# EAGLE design C64 ROM Selector (EAGLE 9.6.1)
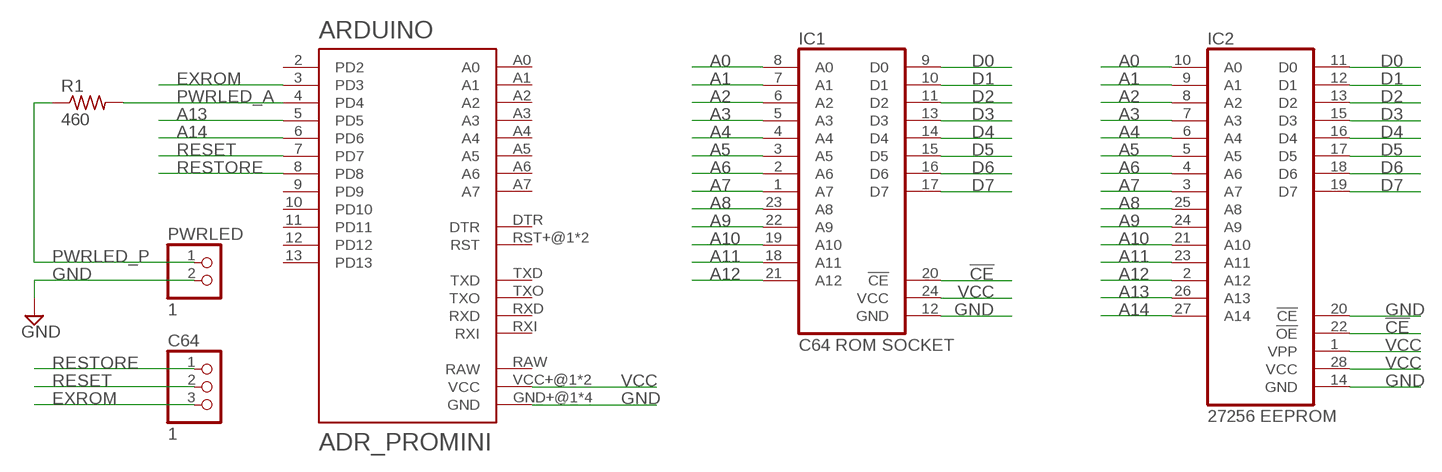
[diagram p0: schematic, sheet 1]

## Parts
ARDUINO  ADR_PROMINI  [ARDUINO_PRO_MINI]
C64  1  PINHD-1X3  [1X03]
IC1  C64 ROM SOCKET  2364  [DIL24]
IC2  27256 EEPROM  27256  [DIL28]
PWRLED  1  PINHD-1X2  [1X02]
R1  460  R-US_0204/7  [0204/7]

## Nets
!CE: IC1.20(!CE) IC2.22(!OE)
A0: IC1.8(A0) IC2.10(A0)
A1: IC1.7(A1) IC2.9(A1)
A2: IC1.6(A2) IC2.8(A2)
A3: IC1.5(A3) IC2.7(A3)
A4: IC1.4(A4) IC2.6(A4)
A5: IC1.3(A5) IC2.5(A5)
A6: IC1.2(A6) IC2.4(A6)
A7: IC1.1(A7) IC2.3(A7)
A8: IC1.23(A8) IC2.25(A8)
A9: IC1.22(A9) IC2.24(A9)
A10: IC1.19(A10) IC2.21(A10)
A11: IC1.18(A11) IC2.23(A11)
A12: IC1.21(A12) IC2.2(A12)
A13: ARDUINO.5(PD5) IC2.26(A13)
A14: ARDUINO.6(PD6) IC2.27(A14)
D0: IC1.9(D0) IC2.11(D0)
D1: IC1.10(D1) IC2.12(D1)
D2: IC1.11(D2) IC2.13(D2)
D3: IC1.13(D3) IC2.15(D3)
D4: IC1.14(D4) IC2.16(D4)
D5: IC1.15(D5) IC2.17(D5)
D6: IC1.16(D6) IC2.18(D6)
D7: IC1.17(D7) IC2.19(D7)
EXROM: ARDUINO.3(PD3) C64.3
GND: ARDUINO.GND+@1(GND) ARDUINO.GND+@2(GND) ARDUINO.GND+@3(GND) ARDUINO.GND+@4(GND) IC1.12(GND) IC2.14(GND) IC2.20(!CE) PWRLED.2
PWRLED_A: ARDUINO.4(PD4) R1.2
PWRLED_P: PWRLED.1 R1.1
RESET: ARDUINO.7(PD7) C64.2
RESTORE: ARDUINO.8(PD8) C64.1
VCC: ARDUINO.VCC+@1(VCC) ARDUINO.VCC+@2(VCC) IC1.24(VCC) IC2.1(VPP) IC2.28(VCC)
Unconnected: ARDUINO.2(PD2) ARDUINO.9(PD9) ARDUINO.10(PD10) ARDUINO.11(PD11) ARDUINO.12(PD12) ARDUINO.13(PD13) ARDUINO.A0 ARDUINO.A1 ARDUINO.A2 ARDUINO.A3 ARDUINO.A4 ARDUINO.A5 ARDUINO.A6 ARDUINO.A7 ARDUINO.DTR ARDUINO.RST+@1(RST) ARDUINO.RST+@2(RST) ARDUINO.RXD ARDUINO.RXI ARDUINO.TXD ARDUINO.TXO

## Power pins joined to a net without a drawn wire
RAW: ARDUINO.RAW

## Library data of the parts
ARDUINO = myparts:ADR_PROMINI
C64 = pinhead:PINHD-1X3: PIN HEADER
IC1 = myparts:2364: MEMORY
IC2 = myparts:27256: MEMORY
PWRLED = pinhead:PINHD-1X2: PIN HEADER
R1 = rcl:R-US_: RESISTOR, American symbol; SPICEPREFIX: R

## Board
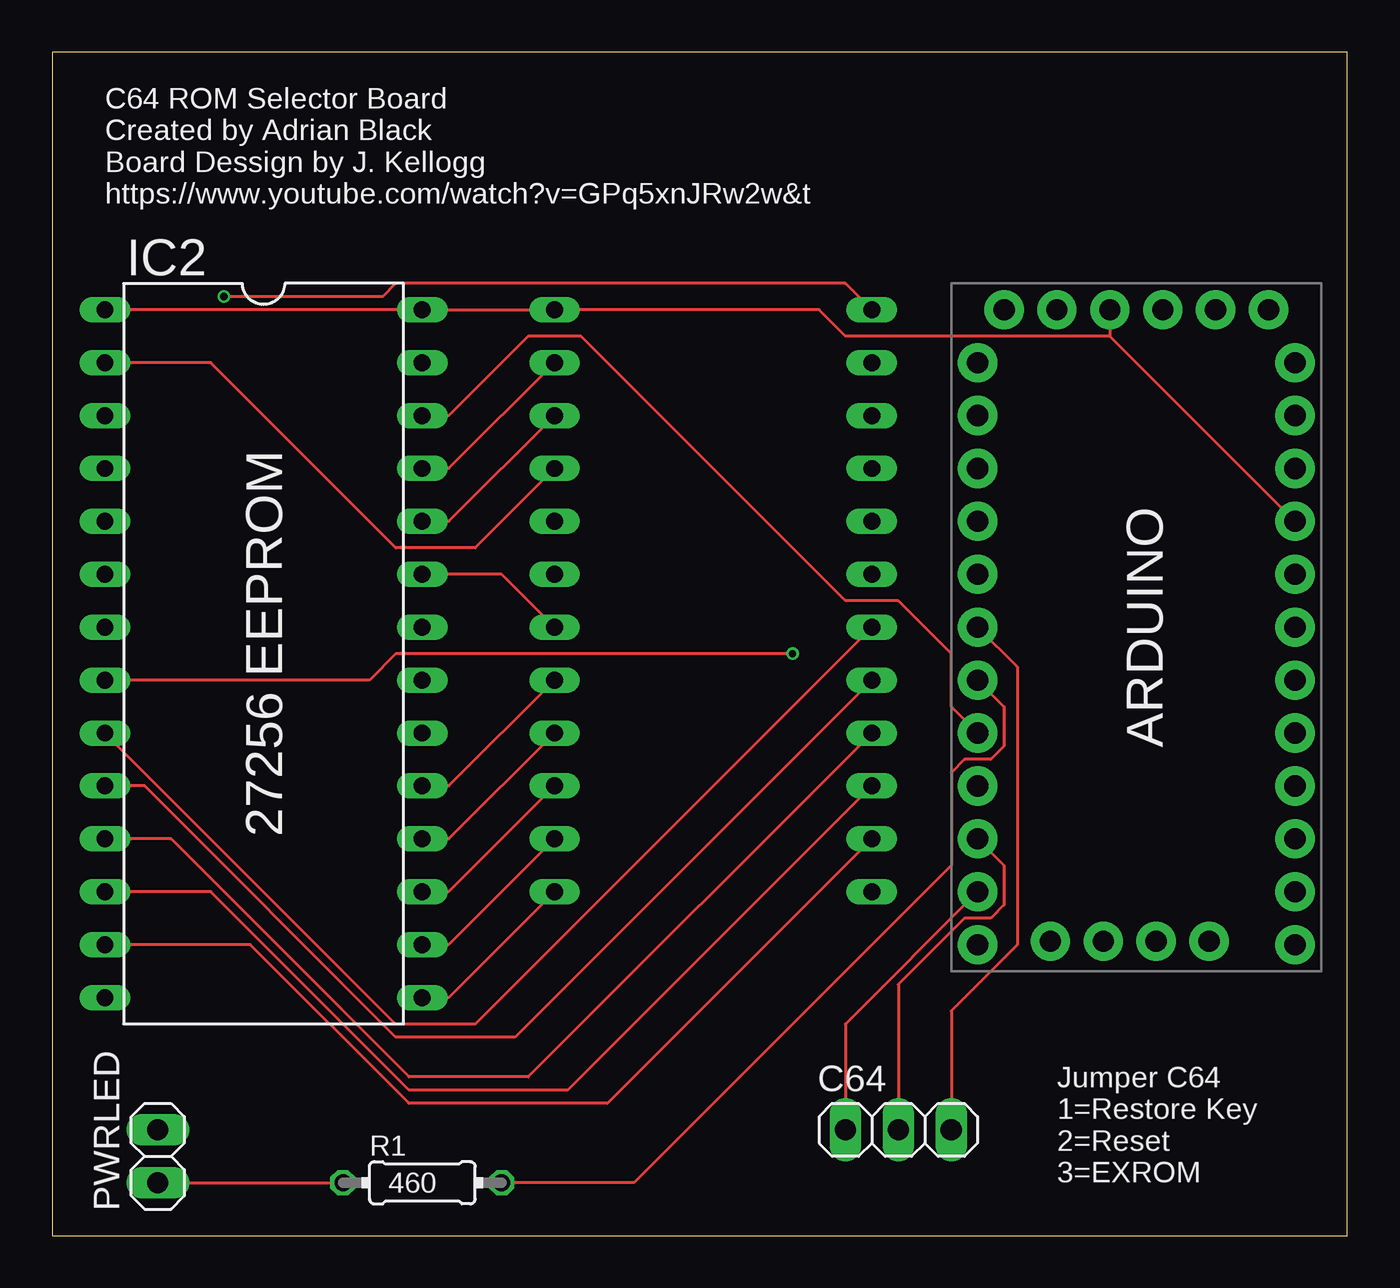
[diagram p1: board, top side]
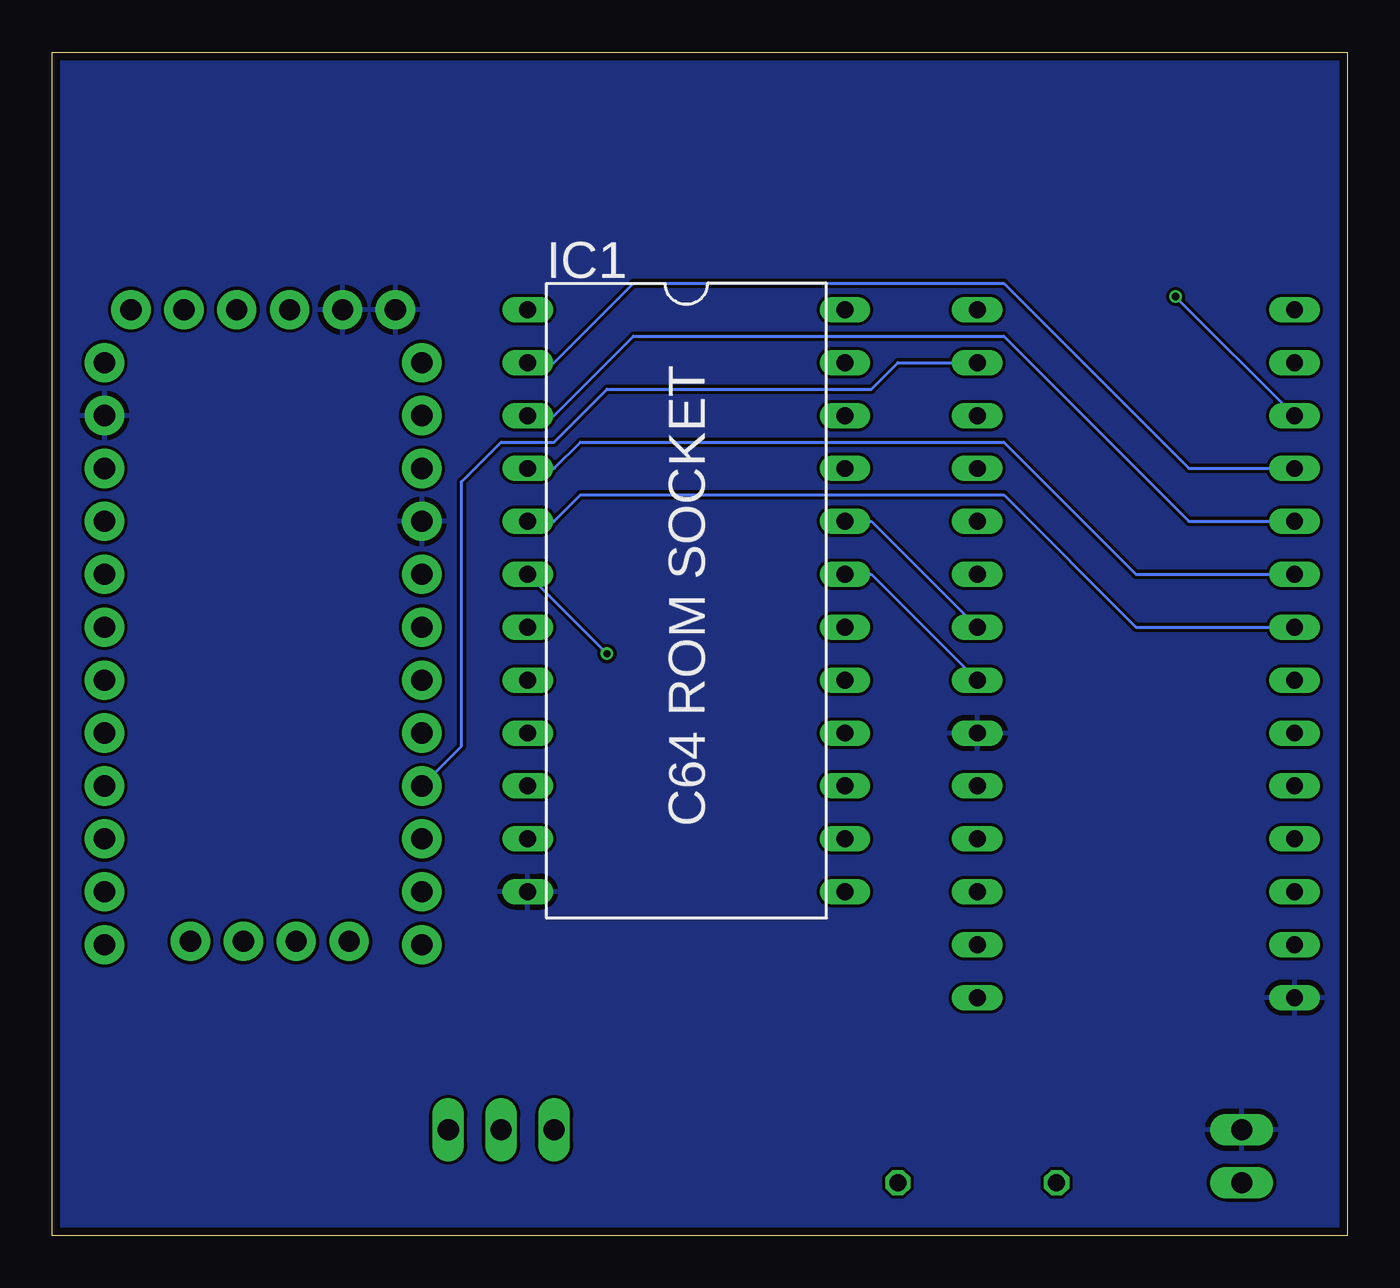
[diagram p2: board, bottom side, seen from below]

Size 62.21 x 56.82 mm. Coordinates in mm from the lower left corner, seen from the top.
Outline: 0,0 62.21,0 62.21,56.82 0,56.82 0,0
Copper layers (1*16): Top 0.035559375mm / dielectric 1.6mm / Bottom 0.035559375mm
Design rules "oshpark-2layer": minimum track width 6mil, minimum drill 10mil, track to track 6mil, track to pad 6mil, pad to pad 6mil, via to via 6mil, smd to smd 6mil, copper to edge 15mil, drill to drill 6mil, minimum pad ring 5mil, minimum via ring 5mil, stop-mask expansion 2.5mil, vias tented up to drill 0mil, thermal gap 10mil

### Footprints (pad centres in the part's own frame; a part is rotated, then mirrored left to right if it is on the bottom)
ARDUINO_PRO_MINI = drill 1.016 pad 1.88: 2 -7.62,2.54; 3 -7.62,0; 4 -7.62,-2.54; 5 -7.62,-5.08; 6 -7.62,-7.62; 7 -7.62,-10.16; 8 -7.62,-12.7; 9 -7.62,-15.24; 10 7.62,-15.24; 11 7.62,-12.7; 12 7.62,-10.16; 13 7.62,-7.62; A0 7.62,-5.08; A1 7.62,-2.54; A2 7.62,0; A3 7.62,2.54; A4 -4.128,-15.081; A5 -1.587,-15.081; A6 0.953,-15.081; A7 3.493,-15.081; DTR 6.35,15.24; GND+@1 -7.62,5.08; GND+@2 7.62,10.16; GND+@3 -3.81,15.24; GND+@4 -6.35,15.24; RAW 7.62,12.7; RST+@1 -7.62,7.62; RST+@2 7.62,7.62; RXD -7.62,10.16; RXI 1.27,15.24; TXD -7.62,12.7; TXO 3.81,15.24; VCC+@1 7.62,5.08; VCC+@2 -1.27,15.24
1X03 = drill 1.016 long: 1 -2.54,0; 2 0,0; 3 2.54,0
DIL24 = drill 0.813 long: 1 -13.97,-7.62; 2 -11.43,-7.62; 3 -8.89,-7.62; 4 -6.35,-7.62; 5 -3.81,-7.62; 6 -1.27,-7.62; 7 1.27,-7.62; 8 3.81,-7.62; 9 6.35,-7.62; 10 8.89,-7.62; 11 11.43,-7.62; 12 13.97,-7.62; 13 13.97,7.62; 14 11.43,7.62; 15 8.89,7.62; 16 6.35,7.62; 17 3.81,7.62; 18 1.27,7.62; 19 -1.27,7.62; 20 -3.81,7.62; 21 -6.35,7.62; 22 -8.89,7.62; 23 -11.43,7.62; 24 -13.97,7.62
DIL28 = drill 0.813 long: 1 -16.51,-7.62; 2 -13.97,-7.62; 3 -11.43,-7.62; 4 -8.89,-7.62; 5 -6.35,-7.62; 6 -3.81,-7.62; 7 -1.27,-7.62; 8 1.27,-7.62; 9 3.81,-7.62; 10 6.35,-7.62; 11 8.89,-7.62; 12 11.43,-7.62; 13 13.97,-7.62; 14 16.51,-7.62; 15 16.51,7.62; 16 13.97,7.62; 17 11.43,7.62; 18 8.89,7.62; 19 6.35,7.62; 20 3.81,7.62; 21 1.27,7.62; 22 -1.27,7.62; 23 -3.81,7.62; 24 -6.35,7.62; 25 -8.89,7.62; 26 -11.43,7.62; 27 -13.97,7.62; 28 -16.51,7.62
1X02 = drill 1.016 long: 1 -1.27,0; 2 1.27,0
0204/7 = drill 0.813 octagon: 1 -3.81,0; 2 3.81,0

### Placement (x,y rotation side)
ARDUINO  52.07,29.21 0 top
C64  40.64,5.08 0 top
IC1  31.75,30.48 270 bottom
IC2  10.16,27.94 270 top
PWRLED  5.08,3.81 90 top
R1  17.78,2.54 0 top

### Tracks (layer width: path | path; a pad name or v marks a point on that pad's centre or on a via)
!CE
  Bottom 0.152: IC2.22 22.86,34.29 IC1.20
A0
  Top 0.152: IC2.10 4.45,21.59 16.51,9.53 22.23,9.53 IC1.8
A1
  Top 0.152: IC2.9 16.51,10.16 20.32,10.16 IC1.7
A2  (via drill 0.35)
  Top 0.152: IC2.8 15.24,26.67 16.51,27.94 v35.56,27.94
  Bottom 0.152: IC1.6 v35.56,27.94
A3
  Bottom 0.152: IC2.7 10.16,29.21 16.51,35.56 36.83,35.56 38.1,34.29 IC1.5
A4
  Bottom 0.152: IC2.6 10.16,31.75 16.51,38.1 36.83,38.1 38.1,36.83 IC1.4
A5
  Bottom 0.152: IC2.5 7.62,34.29 16.51,43.18 34.29,43.18 38.1,39.37 IC1.3
A6
  Bottom 0.152: IC2.4 7.62,36.83 16.51,45.72 34.29,45.72 38.1,41.91 IC1.2
A7  (via drill 0.35)
  Top 0.152: v8.25,45.09 15.88,45.09 16.51,45.72 38.1,45.72 IC1.1
  Bottom 0.152: v8.25,45.09 IC2.3
A8
  Top 0.152: IC2.25 19.05,36.83 IC1.23
A9
  Top 0.152: IC2.24 19.05,34.29 IC1.22
A10
  Bottom 0.152: IC2.21 22.86,31.75 IC1.19
A11
  Top 0.152: IC2.23 21.59,31.75 IC1.18
A12
  Top 0.152: IC2.2 7.62,41.91 16.51,33.02 20.32,33.02 IC1.21
A13
  Top 0.152: IC2.26 19.05,39.37 22.86,43.18 25.4,43.18 38.1,30.48 40.64,30.48 43.18,27.94 43.18,25.4 ARDUINO.5
A14
  Bottom 0.152: IC2.27 21.59,41.91 22.86,40.64 35.56,40.64 38.1,38.1 40.64,38.1 42.55,36.2 42.55,23.5 ARDUINO.6
D0
  Top 0.152: IC2.11 5.72,19.05 17.14,7.62 22.86,7.62 IC1.9
D1
  Top 0.152: IC2.12 7.62,16.51 17.14,6.98 24.77,6.98 IC1.10
D2
  Top 0.152: IC2.13 9.52,13.97 17.14,6.35 26.67,6.35 IC1.11
D3
  Top 0.152: IC2.15 19.05,11.43 IC1.13
D4
  Top 0.152: IC2.16 19.05,13.97 IC1.14
D5
  Top 0.152: IC2.17 19.05,16.51 IC1.15
D6
  Top 0.152: IC2.18 19.05,19.05 IC1.16
D7
  Top 0.152: IC2.19 19.05,21.59 IC1.17
EXROM
  Top 0.152: C64.3 43.18,10.79 46.36,13.97 46.36,27.3 ARDUINO.3
GND
  pour Bottom: 0,0 0,57.15 62.23,57.15 62.23,0
PWRLED_A
  Top 0.152: R1.2 27.94,2.54 43.18,17.78 43.18,22.22 43.81,22.86 45.09,22.86 45.72,23.5 45.72,25.4 ARDUINO.4
PWRLED_P
  Top 0.152: PWRLED.1 R1.1
RESET
  Top 0.152: C64.2 40.64,12.06 43.81,15.24 45.09,15.24 45.72,15.88 45.72,17.78 ARDUINO.7
RESTORE
  Top 0.152: C64.1 38.1,10.16 ARDUINO.8
VCC
  Top 0.152: IC2.1 IC2.28 IC1.24 36.83,44.45 38.1,43.18 50.8,43.18 | 50.8,43.18 ARDUINO.VCC+@1 | ARDUINO.VCC+@2 50.8,43.18

### Text on the board
tPlace: C64 ROM Selector Board / Created by Adrian Black / Board Dessign by J. Kellogg / https://www.youtube.com/watch?v=GPq5xnJRw2w&t | Jumper C64 / 1=Restore Key / 2=Reset / 3=EXROM